# EAGLE design Stackduino (EAGLE 6.5.0)
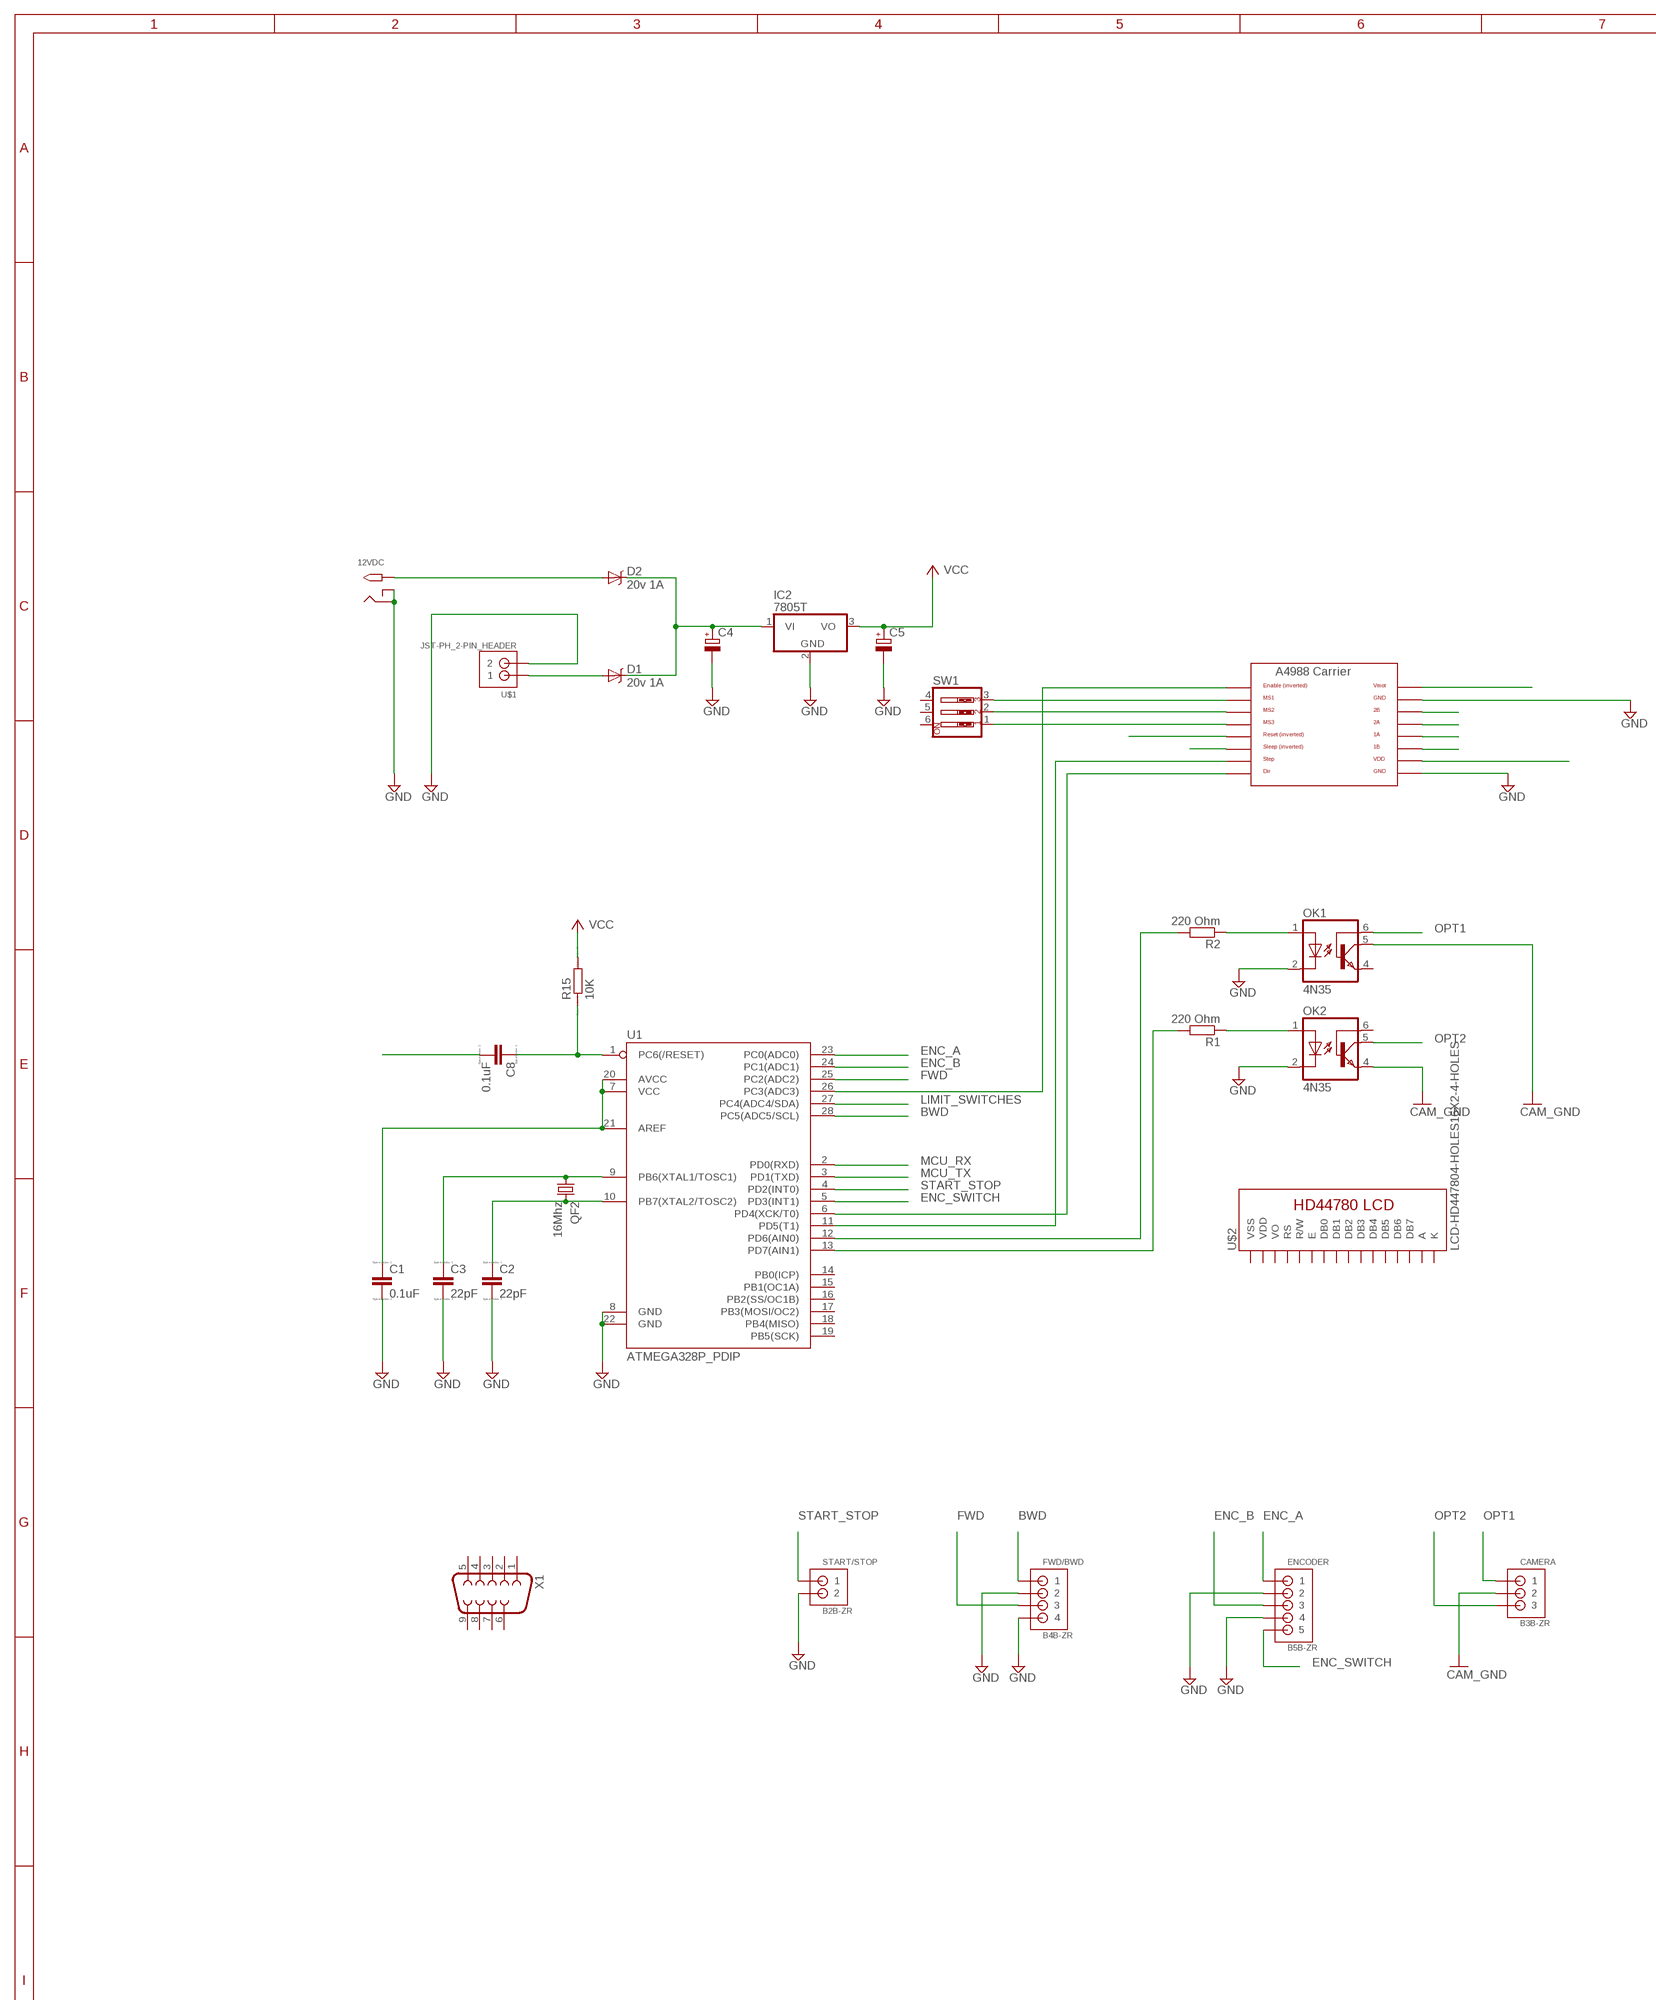
[diagram p0: schematic, sheet 1, part 1 of 2]
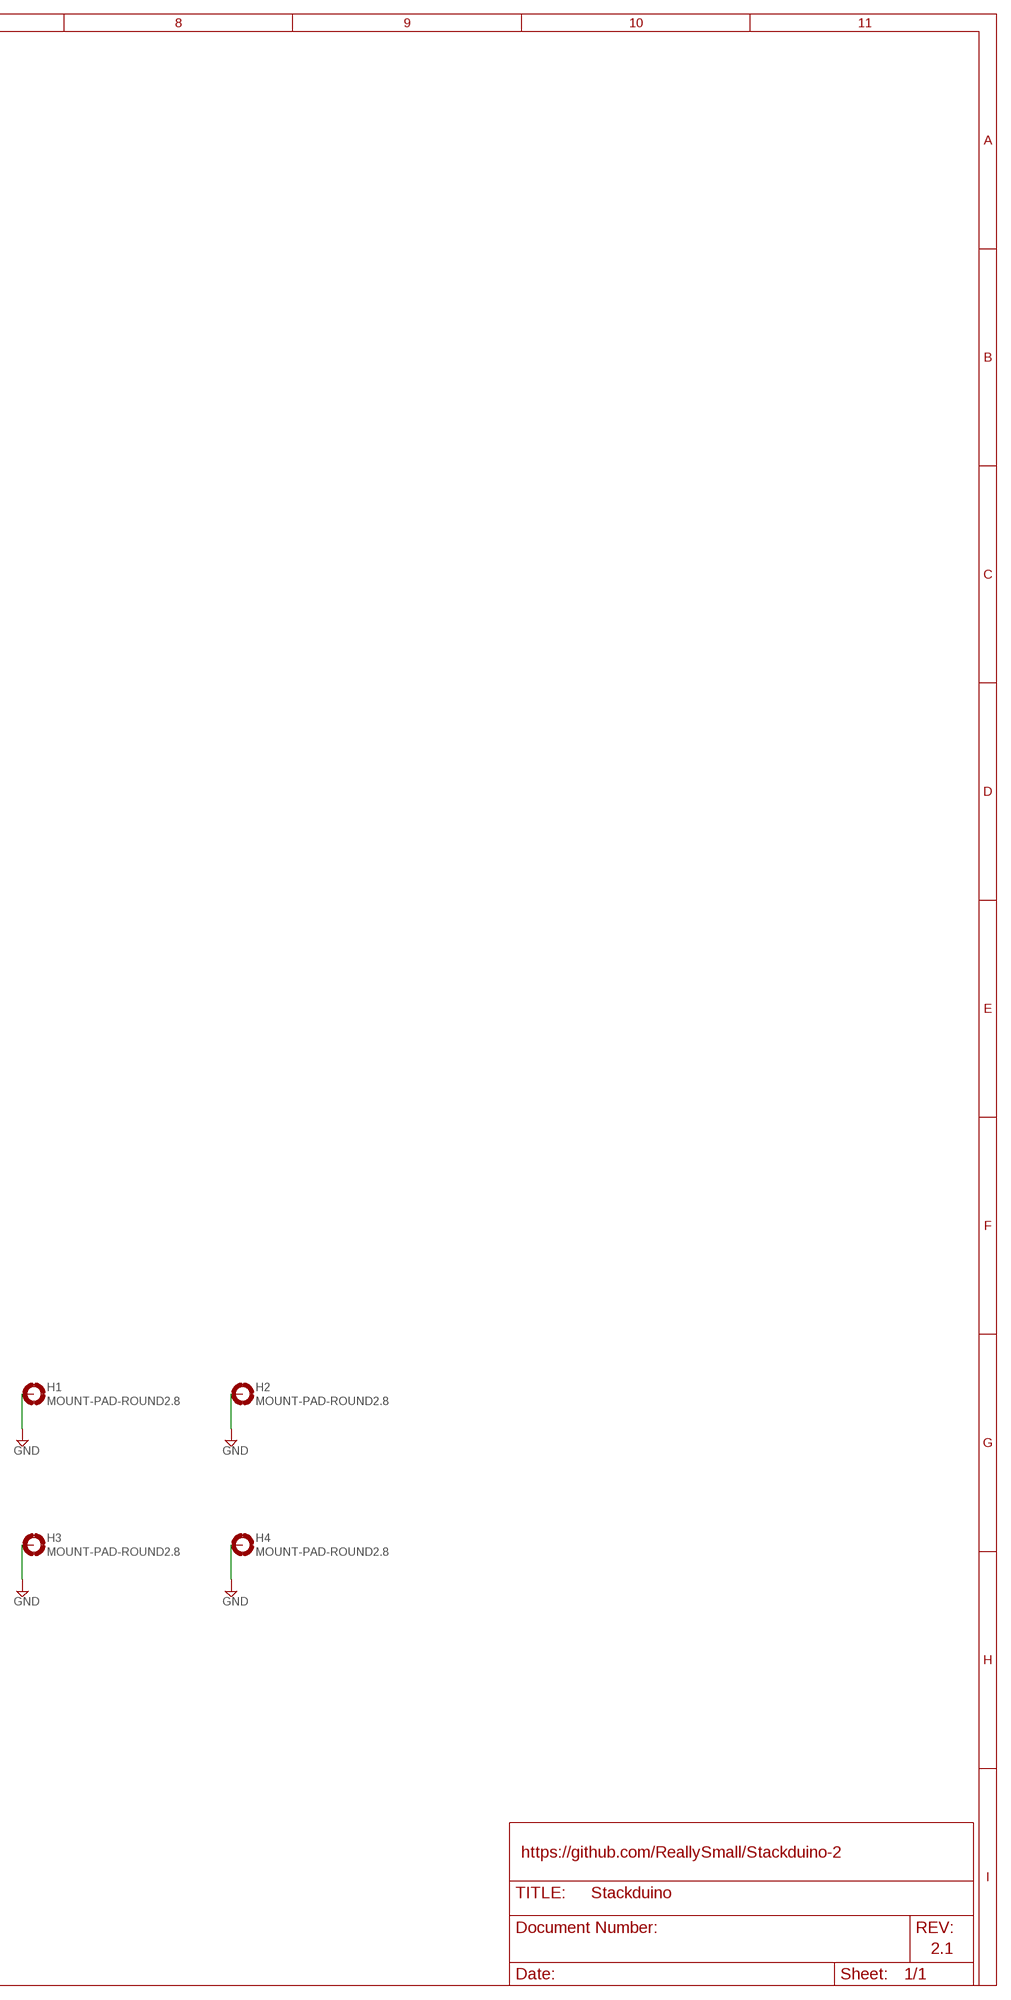
[diagram p1: schematic, sheet 1, part 2 of 2]

## Parts
12VDC  2.1MMJACKTHM  [PJ-102A]
A4988_CARRIER  A4988BREAKOUT  [A4988BREAKOUT]
C1  0.1uF  C  [C0805]
C2  22pF  C  [C0805]
C3  22pF  C  [C0805]
C4  CPOL-EUE7.5-16  [E7,5-16]
C5  CPOL-EUE7.5-16  [E7,5-16]
C8  0.1uF  C  [C0805]
CAMERA  B3B-ZR  [B3B-ZR]
D1  20v 1A  MBRA140  [SMA-DIODE]
D2  20v 1A  MBRA140  [SMA-DIODE]
ENCODER  B5B-ZR  [B5B-ZR]
FWD/BWD  B4B-ZR  [B4B-ZR]
H1  MOUNT-PAD-ROUND2.8  [2,8-PAD]
H2  MOUNT-PAD-ROUND2.8  [2,8-PAD]
H3  MOUNT-PAD-ROUND2.8  [2,8-PAD]
H4  MOUNT-PAD-ROUND2.8  [2,8-PAD]
IC2  7805T  [TO220H]
OK1  4N35  [DIL06]
OK2  4N35  [DIL06]
QF2  16Mhz  CRYSTALHC49U-V  [HC49U-V]
R1  220 Ohm  R-EU_0207/10  [0207/10]
R2  220 Ohm  R-EU_0207/10  [0207/10]
R15  10K  R  [R0805]
START/STOP  B2B-ZR  [B2B-ZR]
SW1  SW_DIP-3  [EDG-03]
U1  ATMEGA328P_PDIP  [DIL28-3]
U$1  JST-PH_2-PIN_HEADER  [JST_B2B-PH_HEADER]
U$2  LCD-HD447804-HOLES16X2-4-HOLES  [LCD-16X2-4HOLES]
X1  F09H  [F09H]

## Nets
+5V: C5.+ IC2.3(VO) ; supply symbol labelled VCC
BWD: FWD/BWD.1 U1.28(PC5(ADC5/SCL))
CAM_GND: CAMERA.2 OK1.5(COL) OK2.4(EMI)
DIR: A4988_CARRIER.DIR U1.6(PD4(XCK/T0))
ENABLE: A4988_CARRIER.EN U1.26(PC3(ADC3))
ENC_A: ENCODER.1 U1.23(PC0(ADC0))
ENC_B: ENCODER.3 U1.24(PC1(ADC1))
ENC_SWITCH: ENCODER.5 U1.5(PD3(INT1))
FWD: FWD/BWD.3 U1.25(PC2(ADC2))
GND: 12VDC.RING 12VDC.RING_SW A4988_CARRIER.GND A4988_CARRIER.GND@0(GND) C1.2 C2.2 C3.2 C4.- C5.- ENCODER.2 ENCODER.4 FWD/BWD.2 FWD/BWD.4 H1.B2,8(MOUNT) H2.B2,8(MOUNT) H3.B2,8(MOUNT) H4.B2,8(MOUNT) IC2.2(GND) OK1.2(C) OK2.2(C) START/STOP.2 U1.8(GND) U1.22(GND) U$1.P2
LIMIT_SWITCHES: U1.27(PC4(ADC4/SDA))
MCU_RX: U1.2(PD0(RXD))
MCU_TX: U1.3(PD1(TXD))
MS1: A4988_CARRIER.MS1 SW1.3
MS2: A4988_CARRIER.MS2 SW1.2
MS3: A4988_CARRIER.MS3 SW1.1
N$1: C8.1 R15.1 U1.1(PC6(/RESET))
N$2: C1.1 U1.7(VCC) U1.20(AVCC) U1.21(AREF)
N$3: R1.2
N$5: C2.1 QF2.2 U1.10(PB7(XTAL2/TOSC2))
N$6: C3.1 QF2.1 U1.9(PB6(XTAL1/TOSC1))
N$8: D1.A U$1.P1
N$10: C8.2
N$11: R2.2
N$12: C4.+ D1.C D2.C IC2.1(VI)
N$13: A4988_CARRIER.RST
N$14: A4988_CARRIER.VMOT
N$34: OK1.1(A) R2.1
N$36: OK2.1(A) R1.1
OPT1: CAMERA.1 OK1.6(BAS)
OPT2: CAMERA.3 OK2.5(COL)
OUT1A: A4988_CARRIER.1B
OUT1B: A4988_CARRIER.1A
OUT2A: A4988_CARRIER.2A
OUT2B: A4988_CARRIER.2B
SLEEP: A4988_CARRIER.SLP(SLEEP)
START_STOP: START/STOP.1 U1.4(PD2(INT0))
STEP: A4988_CARRIER.STEP U1.11(PD5(T1))
VCC: R15.2
VCC1: A4988_CARRIER.VDD
VIN: 12VDC.TIP D2.A
Unconnected: OK1.4(EMI) OK2.6(BAS) SW1.4 SW1.5 SW1.6 U1.12(PD6(AIN0)) U1.13(PD7(AIN1)) U1.14(PB0(ICP)) U1.15(PB1(OC1A)) U1.16(PB2(SS/OC1B)) U1.17(PB3(MOSI/OC2)) U1.18(PB4(MISO)) U1.19(PB5(SCK)) U$2.3(VO) U$2.4(RS) U$2.5(R/W) U$2.6(E) U$2.7(DB0) U$2.8(DB1) U$2.9(DB2) U$2.10(DB3) U$2.11(DB4) U$2.12(DB5) U$2.13(DB6) U$2.14(DB7) X1.1 X1.2 X1.3 X1.4 X1.5 X1.6 X1.7 X1.8 X1.9

## Notes on the sheet
- https://github.com/ReallySmall/Stackduino-2
- 2.1

## Power pins joined to a net without a drawn wire
A: U$2.15(A)
K: U$2.16(K)
VDD: U$2.2(VDD)
VSS: U$2.1(VSS)

## Library data of the parts
12VDC = adafruit:2.1MMJACK: 2.1mm x 5.5mm THM DC jack with internal switch. Digikey part #PJ-102A, 4UCON part #05537 2.1mm x 5.5mm SMT DC jack with internal switch. Digikey part #PJ-002A-SMT, 4UCON part #03267 By microbuilder.eu & adafruit.com
A4988_CARRIER = RepRapjr:A4988BREAKOUT
C1-C3 C8 = eagle-ltspice:C: CAPACITOR, European symbol; SPICEMODEL: NONE; SPICEPREFIX: C
C4 C5 = rcl:CPOL-EU: POLARIZED CAPACITOR, European symbol
CAMERA = jst-connectors:B3B-ZR: JST-ZH Connector 3 pol, 1.5mm pitch Package: B3B-ZR Source: http://www.jst-mfg.com/product/pdf/eng/eZH.pdf
D1 D2 = SparkFun-DiscreteSemi:MBRA140: 40V, 1A Schottky rectifier SMA/DO-214AC package DIO-08053; PROD_ID: DIO-08053
ENCODER = jst-connectors:B5B-ZR: JST-ZH Connector 5 pol, 1.5mm pitch Package: B5B-ZR Source: http://www.jst-mfg.com/product/pdf/eng/eZH.pdf
FWD/BWD = jst-connectors:B4B-ZR: JST-ZH Connector 4 pol, 1.5mm pitch Package: B4B-ZR Source: http://www.jst-mfg.com/product/pdf/eng/eZH.pdf
H1-H4 = holes:MOUNT-PAD-ROUND: MOUNTING PAD, round
IC2 = linear:78*: Positive VOLTAGE REGULATOR Source: http://cache.national.com/ds/LM/LM78L05.pdf http://www.fairchildsemi.com/ds/LM/LM7805.pdf
OK1 OK2 = optocoupler:4N35: MOTOROLA OPTO COUPLER; MF: FAIRCHILD SEMICONDUCTOR; MPN: 4N35; OC_FARNELL: 1328375; OC_NEWARK: 72K9946
QF2 = crystal:CRYSTAL: CRYSTAL; OC_FARNELL: 1666969; OC_NEWARK: unknown
R1 R2 = resistor:R-EU_: RESISTOR, European symbol
R15 = eagle-ltspice:R: RESISTOR, European symbol; SPICEMODEL: NONE; SPICEPREFIX: R
START/STOP = jst-connectors:B2B-ZR: JST-ZH Connector 2 pol, 1.5mm pitch Package: B2B-ZR
SW1 = special:SW_DIP-3: DIP SWITCH
U1 = SparkFun-DigitalIC:ATMEGA328P_PDIP: uC used in the Arduino 32kb flash, 1k EEPROM, 2k SRAM This is the through-hole version of this chip.
U$1 = SRG:JST-PH_2-PIN_HEADER: 2-pin JST PH Shrouded Header, top entry P/N B2B-PH-K-S Mating connector PHR-2 Mating cable assembly: Sparkfun PRT-09914 <http://www.sparkfun.com/products/9914>
U$2 = HD44780LCD:LCD-HD44780
X1 = con-subd:F09: SUB-D; OC_FARNELL: unknown; OC_NEWARK: unknown

## Board
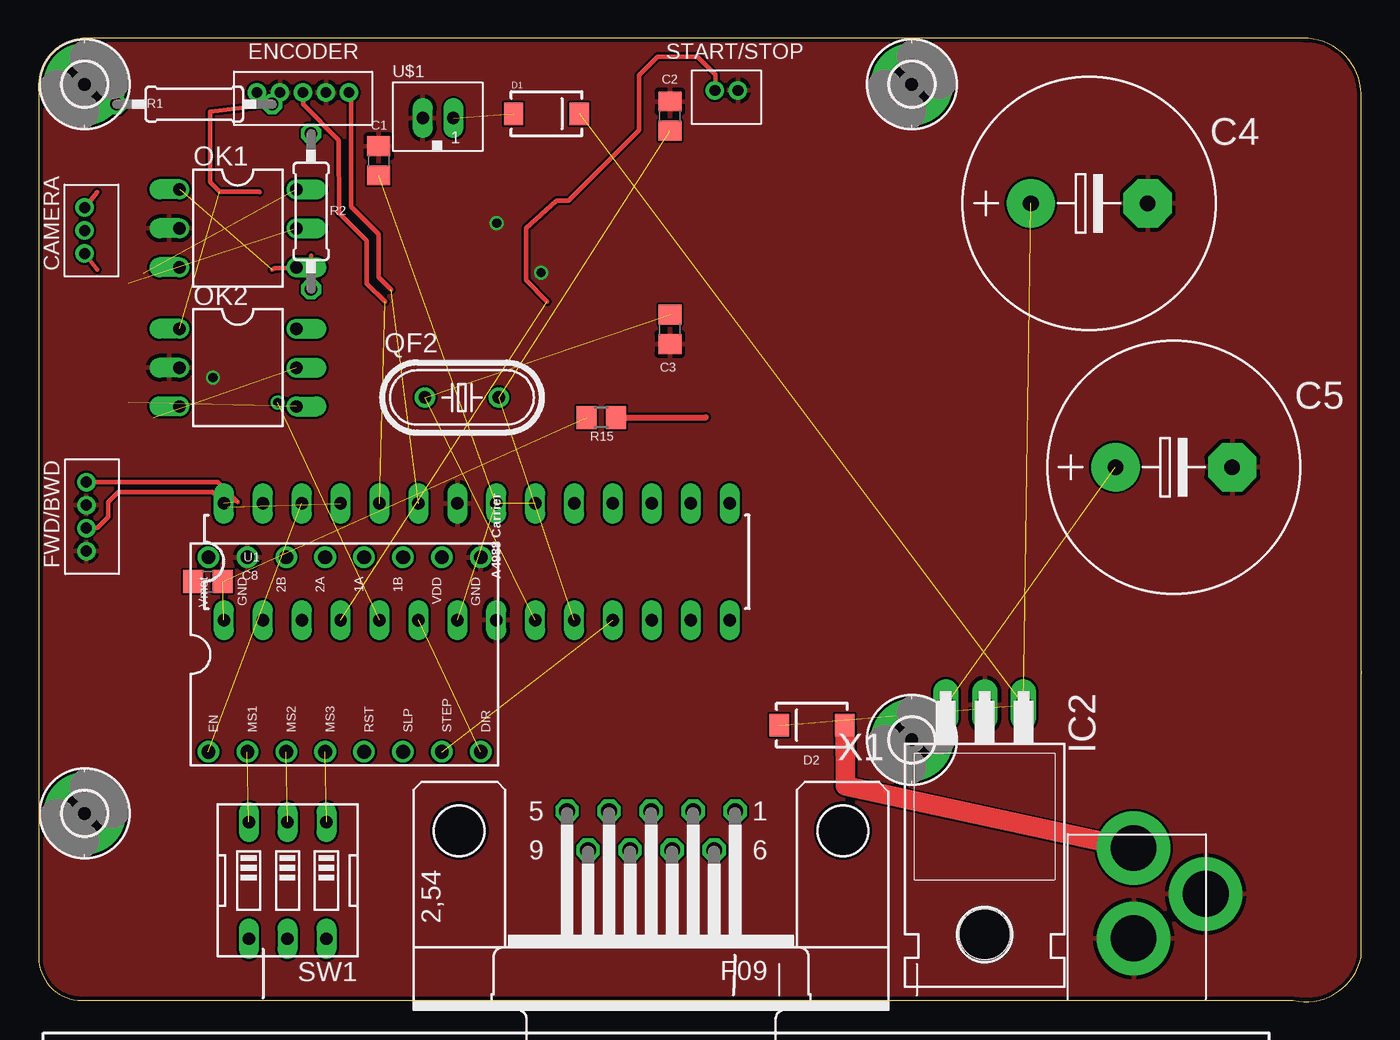
[diagram p2: board, top side]
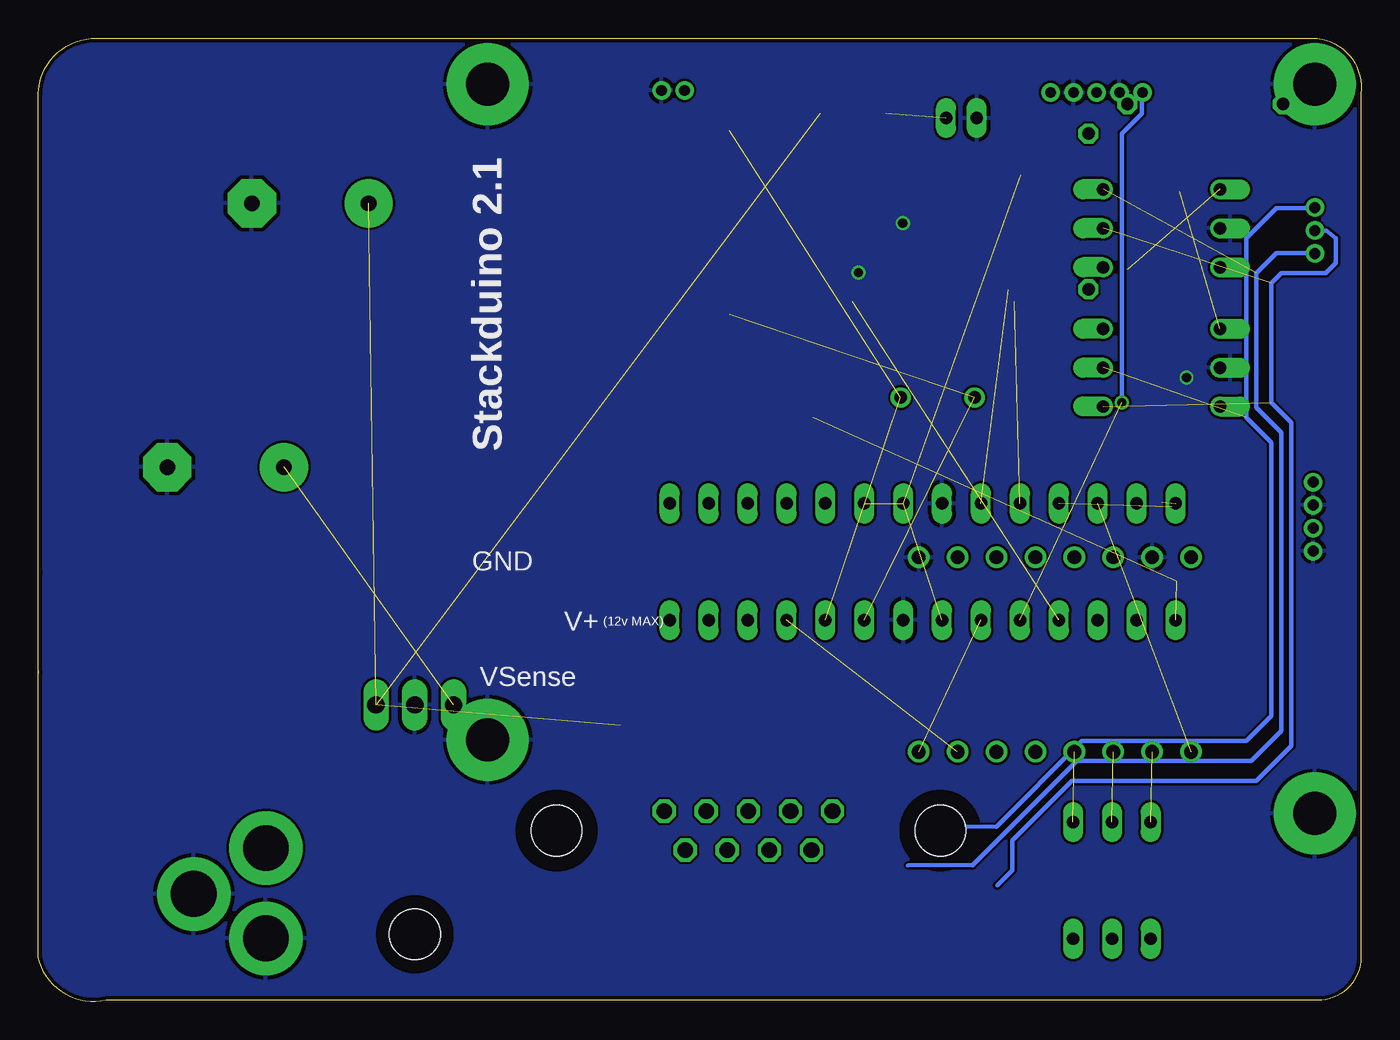
[diagram p3: board, bottom side, seen from below]

Size 86.35 x 62.89 mm. Coordinates in mm from the lower left corner, seen from the top.
Outline: 86.35,2.89 86.35,21.59 86.35,21.44 86.35,27.94 86.35,28.09 86.35,59.26 arc90 82.55,62.89 2.85,62.89 arc90 0.02,59.26 0.02,2.89 arc90 2.82,0.09 81.92,0.09 arc90 86.35,2.89
Copper layers (1*16): Top 0.035mm / dielectric 1.5mm / Bottom 0.035mm
Design rules "SeeedStudio_DRU_no_angle_2layer": minimum track width 6mil, minimum drill 12mil, track to track 6mil, track to pad 6mil, pad to pad 6mil, via to via 6mil, smd to smd 0mil, copper to edge 10mil, drill to drill 10mil, minimum pad ring 10mil, minimum via ring 6mil, stop-mask expansion 2mil, vias tented up to drill 25mil, thermal gap 10mil

### Footprints (pad centres in the part's own frame; a part is rotated, then mirrored left to right if it is on the bottom)
PJ-102A = drill 3 pad 4.8: RING 0.1,-3.39; RING_SW -4.6,-6.29; TIP 0.1,-9.29
A4988BREAKOUT = drill 0.9: 1A 8.89,1.27; 1B 11.43,1.27; 2A 6.35,1.27; 2B 3.81,1.27; DIR 16.51,-11.43; EN -1.27,-11.43; GND 16.51,1.27; GND@0 1.27,1.27; MS1 1.27,-11.43; MS2 3.81,-11.43; MS3 6.35,-11.43; RST 8.89,-11.43; SLP 11.43,-11.43; STEP 13.97,-11.43; VDD 13.97,1.27; VMOT -1.27,1.27
C0805 = smd 1.3 x 1.5: 1 -0.95,0; 2 0.95,0
E7,5-16 = drill 1.016 pad 3.15: + -3.81,0 | drill 1.016 pad 3.15 octagon: - 3.81,0
B3B-ZR = drill 0.7 pad 1.1: 1 -1.5,0; 2 0,0; 3 1.5,0
SMA-DIODE = smd 1.27 x 1.47: A -2.15,0; C 2.15,0
B5B-ZR = drill 0.7: 1 3,0.013; 2 1.5,0.013; 3 0,0.013; 4 -1.5,0.013; 5 -3,0.013
B4B-ZR = drill 0.7: 1 6,-1.3; 2 4.5,-1.3; 3 3,-1.3; 4 1.5,-1.3
2,8-PAD = drill 2.8 pad 5.334: B2,8 0,0
TO220H = drill 1.118 long: 1 -2.54,-10.16; 2 0,-10.16; 3 2.54,-10.16 | hole 3.302: 0,4.826
DIL06 = drill 0.813 offset: 1 -2.54,-3.81; 2 0,-3.81; 3 2.54,-3.81; 4 2.54,3.81; 5 0,3.81; 6 -2.54,3.81
HC49U-V = drill 0.813: 1 -2.413,0; 2 2.413,0
0207/10 = drill 0.813 octagon: 1 -5.08,0; 2 5.08,0
R0805 = smd 1.3 x 1.5: 1 -0.95,0; 2 0.95,0
B2B-ZR = drill 0.7 pad 1.1: 1 0.92,-0.75; 2 2.42,-0.75
EDG-03 = drill 0.813 long: 1 -2.54,-3.81; 2 0,-3.81; 3 2.54,-3.81; 4 2.54,3.81; 5 0,3.81; 6 -2.54,3.81
DIL28-3 = drill 0.813 long: 1 -16.51,-3.81; 2 -13.97,-3.81; 3 -11.43,-3.81; 4 -8.89,-3.81; 5 -6.35,-3.81; 6 -3.81,-3.81; 7 -1.27,-3.81; 8 1.27,-3.81; 9 3.81,-3.81; 10 6.35,-3.81; 11 8.89,-3.81; 12 11.43,-3.81; 13 13.97,-3.81; 14 16.51,-3.81; 15 16.51,3.81; 16 13.97,3.81; 17 11.43,3.81; 18 8.89,3.81; 19 6.35,3.81; 20 3.81,3.81; 21 1.27,3.81; 22 -1.27,3.81; 23 -3.81,3.81; 24 -6.35,3.81; 25 -8.89,3.81; 26 -11.43,3.81; 27 -13.97,3.81; 28 -16.51,3.81
JST_B2B-PH_HEADER = drill 0.8 long: P1 1.075,0.048; P2 -0.925,0.048
LCD-16X2-4HOLES = drill 1.016 square: 1 -32,15.5 | drill 1.016: 2 -29.46,15.5; 3 -26.92,15.5; 4 -24.38,15.5; 5 -21.84,15.5; 6 -19.3,15.5; 7 -16.76,15.5; 8 -14.22,15.5; 9 -11.68,15.5; 10 -9.14,15.5; 11 -6.6,15.5; 12 -4.06,15.5; 13 -1.52,15.5; 14 1.02,15.5; 15 3.56,15.5; 16 6.1,15.5 | hole 3.2: -37.6,15.5; -37.6,-15.5; 37.6,-15.5; 37.6,15.5
F09H = drill 1.016 octagon: 1 -5.486,-1.27; 2 -2.743,-1.27; 3 0,-1.27; 4 2.743,-1.27; 5 5.486,-1.27; 6 -4.115,1.27; 7 -1.372,1.27; 8 1.372,1.27; 9 4.115,1.27 | hole 3.302: -12.522,0; 12.522,0

### Placement (x,y rotation side)
12VDC  71.59,0.73 180 top
A4988_CARRIER  12.37,27.74 0 top
C1  22.22,54.89 90 top
C2  41.22,57.81 90 top
C3  41.22,43.89 270 top
C4  68.6,52.11 0 top
C5  74.12,34.89 0 top
C8  11.07,27.41 180 top
CAMERA  3.02,50.34 90 top
D1  33.17,57.96 0 top
D2  50.5,18.05 180 top
ENCODER  17.27,59.34 0 top
FWD/BWD  1.83,27.91 90 top
H1  3.02,59.89 180 top
H2  57.02,59.89 180 top
H3  3.02,12.29 180 top
H4  57.02,17.09 180 top
IC2  61.77,9.21 180 top
OK1  13.02,50.49 270 top
OK2  13.02,41.39 270 top
QF2  27.65,39.44 0 top
R1  10.18,58.59 180 top
R2  17.8,51.59 90 top
R15  36.75,38.14 0 top
START/STOP  43.25,60.24 0 top
SW1  16.27,7.91 180 top
U1  28.62,28.71 0 top
U$1  26.02,57.64 0 top
U$2  40.32,-20.04 0 top  (outside the outline)
X1  40,11.16 180 top

### Tracks (layer width: path | path; a pad name or v marks a point on that pad's centre or on a via)
+5V  (1 unrouted)
BWD  (1 unrouted)
  Top 0.305: 13.02,32.61 11.72,33.91 2.95,33.91 FWD/BWD.1
CAM_GND  (2 unrouted)
  Bottom 0.305: CAMERA.2 2.27,50.34 1.65,49.84 1.65,48.21 2.3,47.56 5.22,47.56 5.87,46.91 5.87,39.11 4.57,37.81 4.57,16.69 6.85,14.41 18.87,14.41 22.77,10.51 22.77,8.56 23.75,7.59
DIR  (1 unrouted)
ENABLE  (1 unrouted)
ENC_A  (1 unrouted)
  Top 0.305: ENCODER.1 20.42,58.89 20.42,51.89 22.22,50.09 22.22,47.29 23.02,46.49
ENC_B  (1 unrouted)
  Top 0.305: 22.62,45.69 21.42,46.89 21.42,49.69 19.62,51.49 19.62,56.24 17.27,58.59 ENCODER.3
ENC_SWITCH  (via drill 0.6)  (1 unrouted)
  Bottom 0.305: v15.62,39.11 15.62,56.66 14.32,57.96 14.32,59.26 ENCODER.5
FWD  (1 unrouted)
  Top 0.305: 12.37,32.29 11.4,33.26 5.22,33.26 4.57,32.61 4.57,31.64 3.86,30.92 3.71,30.92 FWD/BWD.3
GND  (via drill 0.6)
  other vias: 32.82,47.59 11.4,40.74 29.92,50.81
  pour Top (rank 2): -1.2,64.51 56.02,64.11 arc-90 88.55,58.21 88.55,3.63 arc-90 56.01,-1.65 3.57,-1.39 arc-90 -1.04,4.36
  pour Bottom: 88.22,63.24 88.87,0.09 arc-90 57.25,-0.81 1.6,-0.81 arc-90 -1.2,10.59 -1.53,64.64
MS1  (1 unrouted)
MS2  (1 unrouted)
MS3  (1 unrouted)
N$1  (2 unrouted)
N$2  (3 unrouted)
N$5  (2 unrouted)
N$6  (2 unrouted)
N$8  (1 unrouted)
N$12  (3 unrouted)
N$34  (1 unrouted)
  Top 0.305: 15.26,47.78 15.42,47.89 17.22,47.89 17.82,48.49 17.82,48.69 arc4 R2.1
N$36  (1 unrouted)
  Top 0.305: 14.45,52.86 14.42,52.89 11.82,52.89 11.22,53.49 11.22,58.09 R1.1
OPT1  (1 unrouted)
  Top 0.305: 3.83,47.78 CAMERA.1
  Bottom 0.254: 25.37,8.89 29.6,8.89
  Bottom 0.305: CAMERA.1 3.27,48.86 5.55,48.86 6.85,47.56 6.85,38.79 5.22,37.16 5.22,17.66 7.17,15.71 18.55,15.71 25.37,8.89
OPT2  (1 unrouted)
  Top 0.305: 3.83,52.86 CAMERA.3
  Bottom 0.254: 23.81,11.42 27.4,11.42
  Bottom 0.305: CAMERA.3 3.6,51.79 5.55,51.79 7.5,49.84 7.5,38.14 5.87,36.51 5.87,18.64 7.5,17.01 18.22,17.01 23.81,11.42
START_STOP  (1 unrouted)
  Top 0.305: 33.22,45.69 31.82,47.09 31.82,50.49 33.82,52.29 34.62,52.29 39.22,56.89 39.22,60.49 40.42,61.69 43.02,61.69 44.2,60.51 44.2,59.88 START/STOP.1
STEP  (1 unrouted)
VCC
  Top 0.406: R15.2 43.57,38.14
VIN
  Top 1.27: D2.A 52.67,14.09 12VDC.TIP

### Text on the board
tPlace: A4988 Carrier
bPlace: Stackduino 2.1
bNames: GND | (12v MAX) | V+ | VSense